# EAGLE design Analog Input Reased and Protection Circuit (EAGLE 9.6.2)
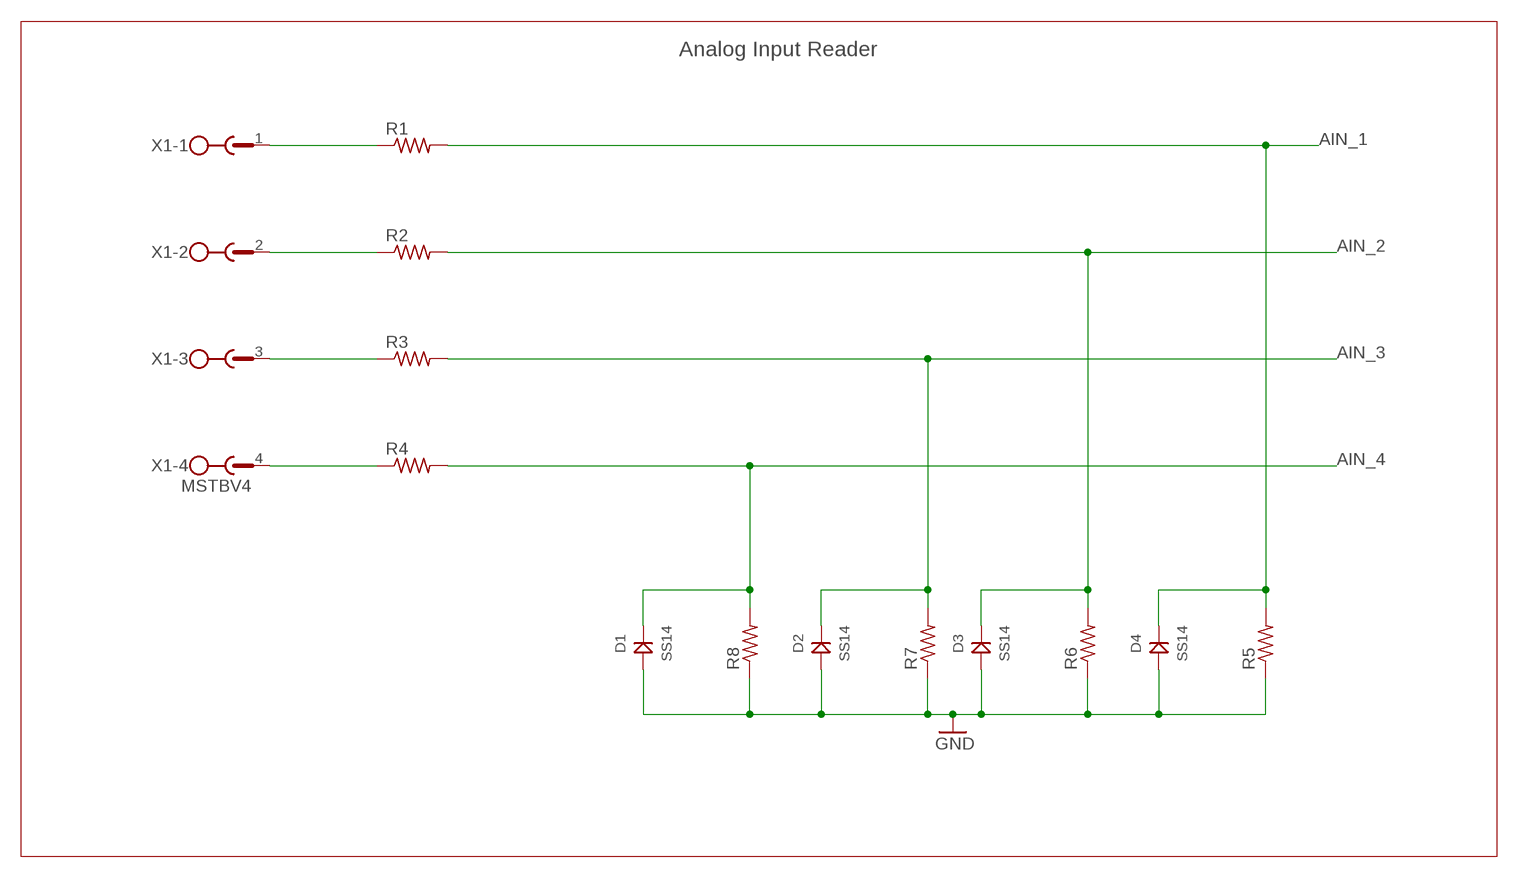
[diagram p0: schematic, sheet 1]

## Parts
D1  SS14  [DO214]
D2  SS14  [DO214]
D3  SS14  [DO214]
D4  SS14  [DO214]
R1  R-US_R0805  [R0805]
R2  R-US_R0805  [R0805]
R3  R-US_R0805  [R0805]
R4  R-US_R0805  [R0805]
R5  R-US_R0805  [R0805]
R6  R-US_R0805  [R0805]
R7  R-US_R0805  [R0805]
R8  R-US_R0805  [R0805]
X1  MSTBV4  [MSTBV4]

## Nets
AIN_1: D4.CATHODE(KATHODE) R1.2 R5.2
AIN_2: D3.CATHODE(KATHODE) R2.2 R6.2
AIN_3: D2.CATHODE(KATHODE) R3.2 R7.2
AIN_4: D1.CATHODE(KATHODE) R4.2 R8.2
GND: D1.ANODE D2.ANODE D3.ANODE D4.ANODE R5.1 R6.1 R7.1 R8.1
N$1: R1.1 X1.1
N$2: R2.1 X1.2
N$3: R3.1 X1.3
N$4: R4.1 X1.4

## Notes on the sheet
- Analog Input Reader

## Library data of the parts
D1-D4 = PC_Diode_SS14:SS14; AVAILABILITY: Unavailable; DESCRIPTION: SS14 Series 500 mV 1 A 40 V Max Reverse Voltage Schottky Rectifier - DO-214AC; MF: ON Semiconductor; MP: SS14; PACKAGE: DO-214AC-214 ON Semiconductor; PRICE: None
R1-R8 = rcl:R-US_: RESISTOR, American symbol; SPICEPREFIX: R
X1 = con-phoenix-508:MSTBV4: PHOENIX; MPN: MSTBV 2,5/4-GF-5.08; OC_FARNELL: 1792794; OC_NEWARK: 69R9847

## Board
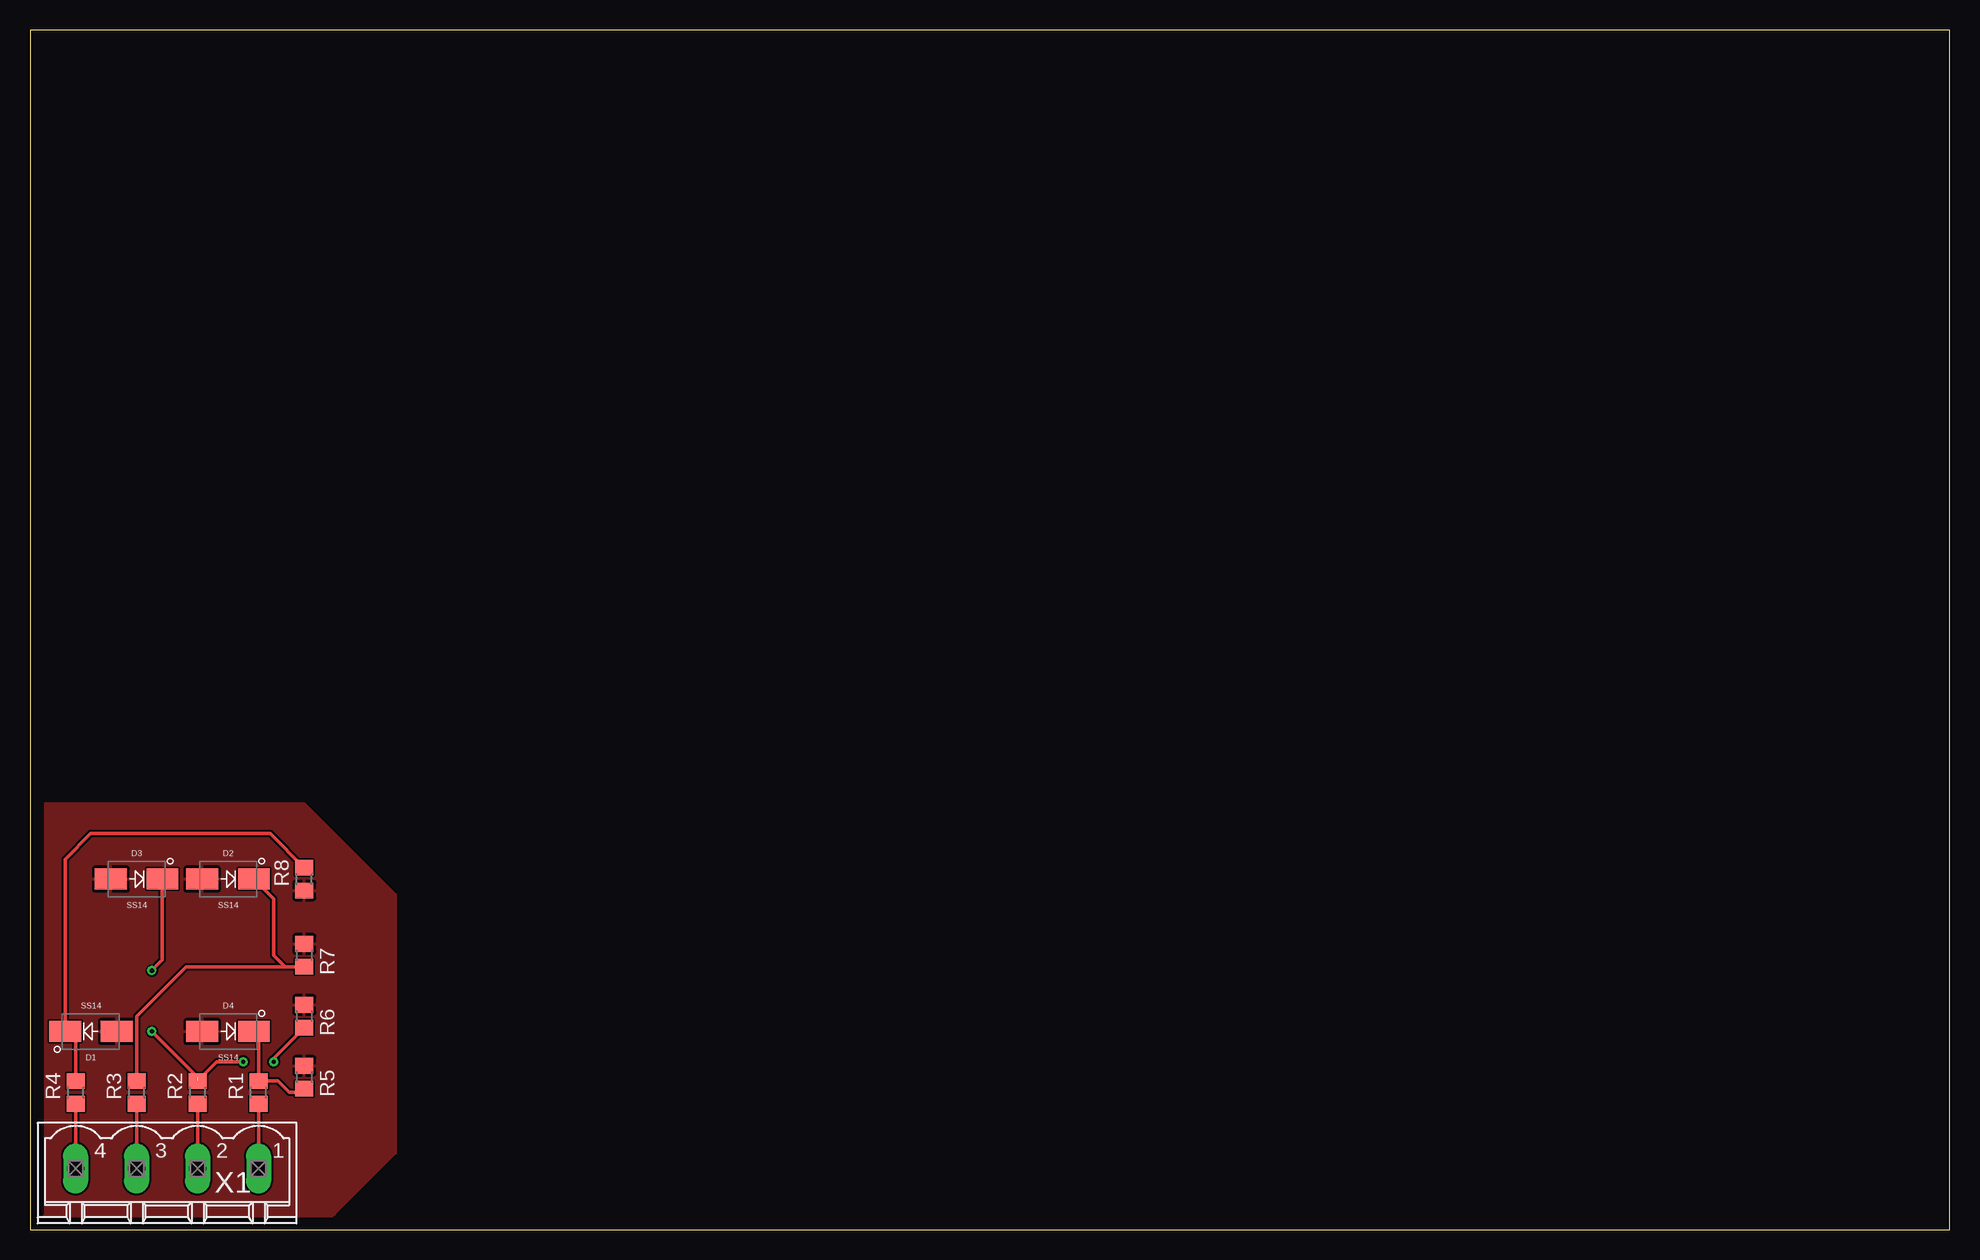
[diagram p1: board, top side]
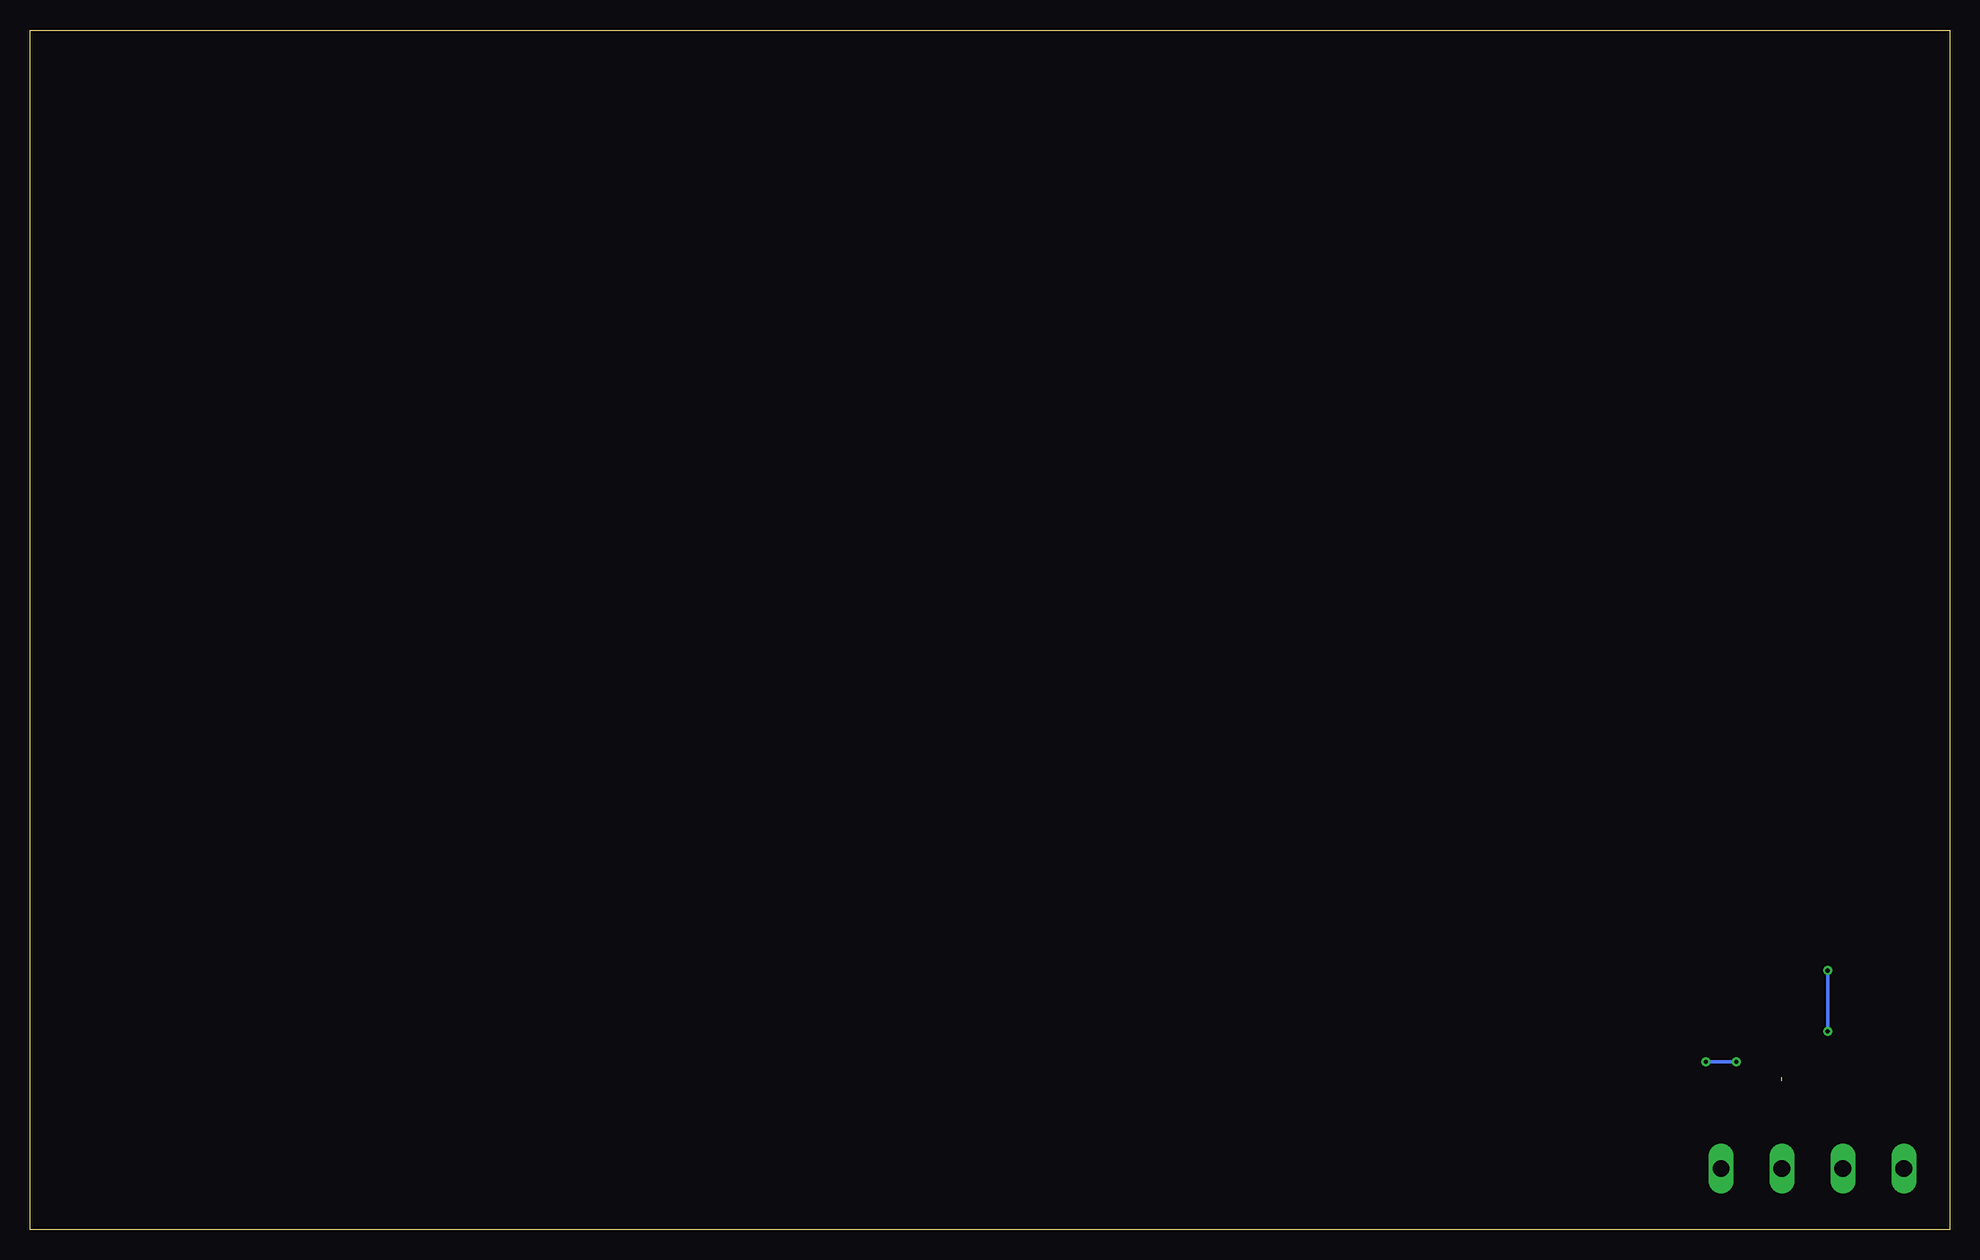
[diagram p2: board, bottom side, seen from below]

Size 160 x 100 mm. Coordinates in mm from the lower left corner, seen from the top.
Outline: 0,0 160,0 160,100 0,100 0,0
Copper layers (1*16): Top 0.035mm / dielectric 1.5mm / Bottom 0.035mm
Design rules "default": minimum track width 6mil, minimum drill 0.35mm, track to track 6mil, track to pad 6mil, pad to pad 6mil, via to via 6mil, smd to smd 6mil, copper to edge 40mil, drill to drill 6mil, minimum pad ring 10mil, minimum via ring 8mil, stop-mask expansion 4mil, vias tented up to drill 0mil, thermal gap 10mil

### Footprints (pad centres in the part's own frame; a part is rotated, then mirrored left to right if it is on the bottom)
DO214 = smd 2.65 x 1.75: ANODE -2.15,0; CATHODE 2.15,0
R0805 = smd 1.3 x 1.5: 1 -0.95,0; 2 0.95,0
MSTBV4 = drill 1.397 long: 1 -7.62,0; 2 -2.54,0; 3 2.54,0; 4 7.62,0

### Placement (x,y rotation side)
D1  5.08,16.51 180 top
D2  16.51,29.21 0 top
D3  8.89,29.21 0 top
D4  16.51,16.51 0 top
R1  19.05,11.43 90 top
R2  13.97,11.43 90 top
R3  8.89,11.43 90 top
R4  3.81,11.43 90 top
R5  22.86,12.7 270 top
R6  22.86,17.78 270 top
R7  22.86,22.86 270 top
R8  22.86,29.21 90 top
X1  11.43,5.08 180 top

### Tracks (layer width: path | path; a pad name or v marks a point on that pad's centre or on a via)
AIN_1
  Top 0.305: R5.2 22.54,11.43 21.59,11.43 20.64,12.38 R1.2 19.05,16.12 D4.CATHODE
AIN_2  (via drill 0.35)  (1 unrouted)
  Top 0.305: R2.2 15.56,13.97 v17.78,13.97 | v20.32,13.97 20.32,14.29 R6.2 | D3.CATHODE 11.04,22.47 v10.16,21.59 | v10.16,16.51 13.97,12.7
  Bottom 0.305: v17.78,13.97 v20.32,13.97 | v10.16,21.59 v10.16,16.51
AIN_3
  Top 0.305: D2.CATHODE 20.32,27.55 20.32,22.86 21.27,21.91 | 21.27,21.91 21.59,21.91 R7.2 | R3.2 8.89,17.78 13.02,21.91 21.27,21.91
AIN_4
  Top 0.305: R4.2 3.81,15.63 D1.CATHODE 2.93,30.87 5.08,33.02 20,33.02 R8.2
GND
  pour Top: 1.27,35.56 22.86,35.56 30.48,27.94 30.48,6.35 25.4,1.27 24.13,0 0,0 1.27,1.27
N$1
  Top 0.305: R1.1 X1.1
N$2
  Top 0.305: R2.1 X1.2
N$3
  Top 0.305: R3.1 X1.3
N$4
  Top 0.305: R4.1 X1.4